# Altium schematic sheet control.SchDoc
size A; SheetNumber: 2; SheetTotal: 3
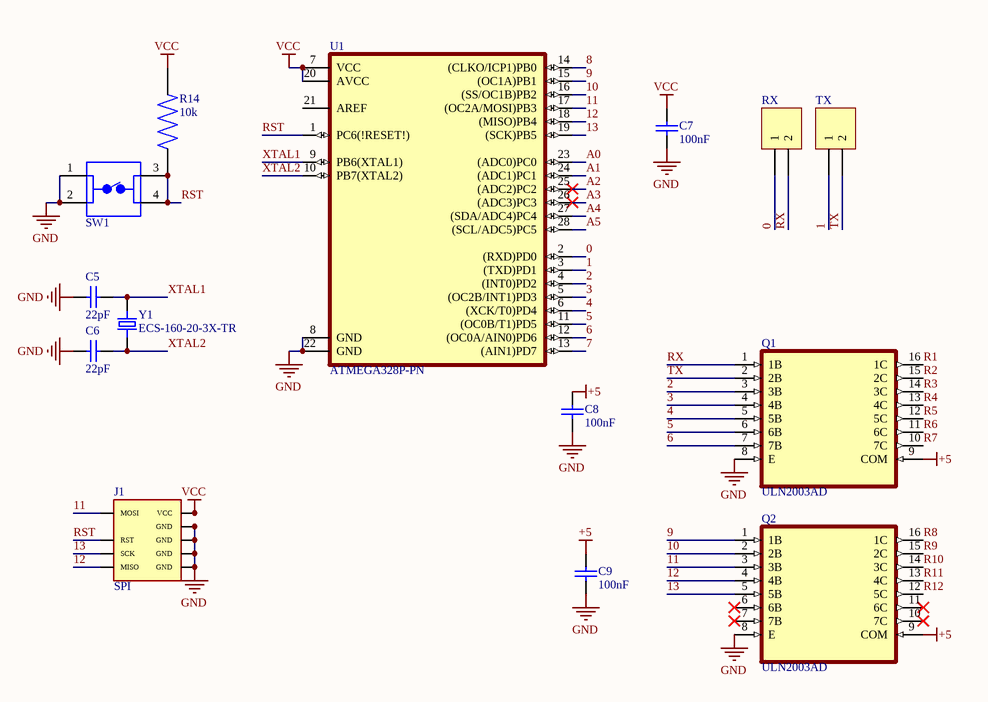
[diagram p0: control.SchDoc]

## Parts
C5  Capacitance: 22pF  [0603_WAVE]  (hidden comment: Ceramic Cap)
C6  Capacitance: 22pF  [0603_WAVE]  (hidden comment: Ceramic Cap)
C7  Capacitance: 100nF  [0603_WAVE]  (hidden comment: Ceramic Cap)
C8  Capacitance: 100nF  [0603_WAVE]  (hidden comment: Ceramic Cap)
C9  Capacitance: 100nF  [0603_WAVE]  (hidden comment: Ceramic Cap)
J1  SPI  [idc10]
Q1  ULN2003AD  [SOIC127P600X175-16N]
Q2  ULN2003AD  [SOIC127P600X175-16N]
R14  value 10k  [1206]  (hidden comment: 1206 Res)
RX  Header 2  [HDR1X2]  (value not drawn)
SW1  6x4mm Pb  [6x4mm Pb]  (value not drawn)
TX  Header 2  [HDR1X2]  (value not drawn)
U1  ATMEGA328P-PN  [DIL28]
Y1  ECS-160-20-3X-TR  [XTAL_ECS-160-20-3X-TR]

## Nets
+5: C8.2 C9.2 Q1.9(COM) Q2.9(COM)
GND: C5.2 C6.2 C7.1 C8.1 C9.1 J1.4(GND) J1.6(GND) J1.8(GND) J1.10(GND) Q1.8(E) Q2.8(E) SW1.1 SW1.2 U1.8(GND) U1.22(GND)
VCC: C7.2 J1.2(VCC) R14.2 U1.7(VCC) U1.20(AVCC)
0: RX.1 U1.2((RXD)PD0)
1: TX.1 U1.3((TXD)PD1)
2: Q1.3(3B) U1.4((INT0)PD2)
3: Q1.4(4B) U1.5((OC2B/INT1)PD3)
4: Q1.5(5B) U1.6((XCK/T0)PD4)
5: Q1.6(6B) U1.11((OC0B/T1)PD5)
6: Q1.7(7B) U1.12((OC0A/AIN0)PD6)
7: U1.13((AIN1)PD7)
8: U1.14((CLKO/ICP1)PB0)
9: Q2.1(1B) U1.15((OC1A)PB1)
10: Q2.2(2B) U1.16((SS/OC1B)PB2)
11: J1.1(MOSI) Q2.3(3B) U1.17((OC2A/MOSI)PB3)
12: J1.9(MISO) Q2.4(4B) U1.18((MISO)PB4)
13: J1.7(SCK) Q2.5(5B) U1.19((SCK)PB5)
A0: U1.23((ADC0)PC0)
A1: U1.24((ADC1)PC1)
A2: U1.25((ADC2)PC2)
A3: U1.26((ADC3)PC3)
A4: U1.27((SDA/ADC4)PC4)
A5: U1.28((SCL/ADC5)PC5)
R1: Q1.16(1C)
R2: Q1.15(2C)
R3: Q1.14(3C)
R4: Q1.13(4C)
R5: Q1.12(5C)
R6: Q1.11(6C)
R7: Q1.10(7C)
R8: Q2.16(1C)
R9: Q2.15(2C)
R10: Q2.14(3C)
R11: Q2.13(4C)
R12: Q2.12(5C)
RST: J1.5(RST) R14.1 SW1.3 SW1.4 U1.1(PC6(!RESET!))
RX: Q1.1(1B) RX.2
TX: Q1.2(2B) TX.2
XTAL1: C5.1 U1.9(PB6(XTAL1)) Y1.2
XTAL2: C6.1 U1.10(PB7(XTAL2)) Y1.1

Not connected (* = marked no-connect by the designer): Q2 6(6B)* 7(7B)* 10(7C)* 11(6C)*; U1 21(AREF)

## Library data of the parts
C5-C9 = Ceramic Cap: WCAP-CSGP Multilayer Ceramic Chip Capacitor, General Purpose, size 1812, X7R; Manufacturer Part Number: 885012210019; Manufacturer: Wurth Elektronik; Rated Voltage: 50VDC; Isolation Resistance: >=10GOhm; Capacitance Tolerance: +/-10%; Technical Reference: X7R1812103K050DFCT10000; ComponentLink1Description: Manufacturer; ComponentLink1URL: http://www.we-online.de; ComponentLink2Description: Datasheet; ComponentLink2URL: https://www.we-online.com/catalog/datasheet/885012210019.pdf; Operating Temperature: -55 to +125degC; Packaging: Tape and Reel; Published Date: May 2020; Ceramic Type: X7R; Dissipation Factor: =<2.5%; Height: 1.25mm; Mounting Technology: SMT; Size: 1812
Q1 Q2 = ULN2003AD: High-Voltage, High-Current Darlington Transistor Arrays; MF: Texas Instruments; Mouser-Purchase-URL: https://snapeda.com/shop?store=Mouser&id=152260; SnapEDA_Link: https://www.snapeda.com/parts/ULN2003AD/Texas%20Instruments/view-part/152260/?ref=snap; Availability: Unavailable; Value: *; Price: None; Arrow_Electronics-Purchase-URL: https://snapeda.com/shop?store=Arrow+Electronics&id=152260; MP: ULN2003AD; DigiKey-Purchase-URL: https://snapeda.com/shop?store=DigiKey&id=152260; Package: SOIC-16 Texas Instruments
R14 = 1206 Res: Res 1206 10 Ohm 5% 1/8W Â±500ppm/Â°C Molded SMD SMD T/R; Resistance: 10; MP: FCR1206J10R; Power_Rating: .125 W; MF: TE Connectivity; DigiKey-Purchase-URL: https://snapeda.com/shop?store=DigiKey&id=988597; Package: 1206; EU_RoHS_Compliance: Compliant with Exemptions; Tolerance: 5%; Price: None; SnapEDA_Link: https://www.snapeda.com/parts/FCR1206J10R/TE%20Connectivity%20Passive%20Product/view-part/988597/?ref=snap; Mouser-Purchase-URL: https://snapeda.com/shop?store=Mouser&id=988597; Availability: Warning
RX TX = Header 2: Header, 2-Pin; LatestRevisionDate: 17-Jul-2002; LatestRevisionNote: Re-released for DXP Platform.; Publisher: Altium Limited
SW1 = 6x4mm Pb: Switch Push Button OFF _ON_ SPST Round Button 0.05A 24VDC Momentary Contact PC Pins Thru-Hole; MF: TE Connectivity; MP: 3-1825910-1; Availability: Unavailable; SnapEDA_Link: https://www.snapeda.com/parts/3-1825910-1/TE%20Connectivity%20ALCOSWITCH%20Switches/view-part/452461/?ref=snap; Price: None; EU_RoHS_Compliance: Compliant; Package: None; TE_purchase_URL: https://www.te.com/usa-en/product-3-1825910-1.html?te_bu=Cor&te_type=disp&te_campaign=seda_glo_cor-seda-global-disp-prtnr-fy19-seda-model-bom-cta_sma-317_1&elqCampaignId=32493; Value: *
U1 = ATMEGA328P-PN: AVR AVRÂ® ATmega Microcontroller IC 8-Bit 20MHz 32KB _16K x 16_ FLASH 28-PDIP; MF: Microchip; Availability: Unavailable; SnapEDA_Link: https://www.snapeda.com/parts/ATMEGA328P-PN/Microchip/view-part/396640/?ref=snap; Price: None; Package: PDIP-28 Atmel; MP: ATMEGA328P-PN; Value: *
Y1 = ECS-160-20-3X-TR: 16MHz Â±30ppm Crystal 20pF 50 Ohms HC-49/US; MF: ECS Inc.; Digi-Key_Part_Number: XC1776CT-ND; Digi-Key_Purchase_URL: https://www.digikey.com/product-detail/en/ecs-inc/ECS-160-20-3X-TR/XC1776CT-ND/2676640?utm_source=snapeda&utm_medium=aggregator&utm_campaign=symbol; Package: HC49/US ECS International; MP: ECS-160-20-3X-TR; Value: *; SnapEDA_Link: https://www.snapeda.com/parts/ECS-160-20-3X-TR/ECS%20Inc./view-part/561589/?ref=snap